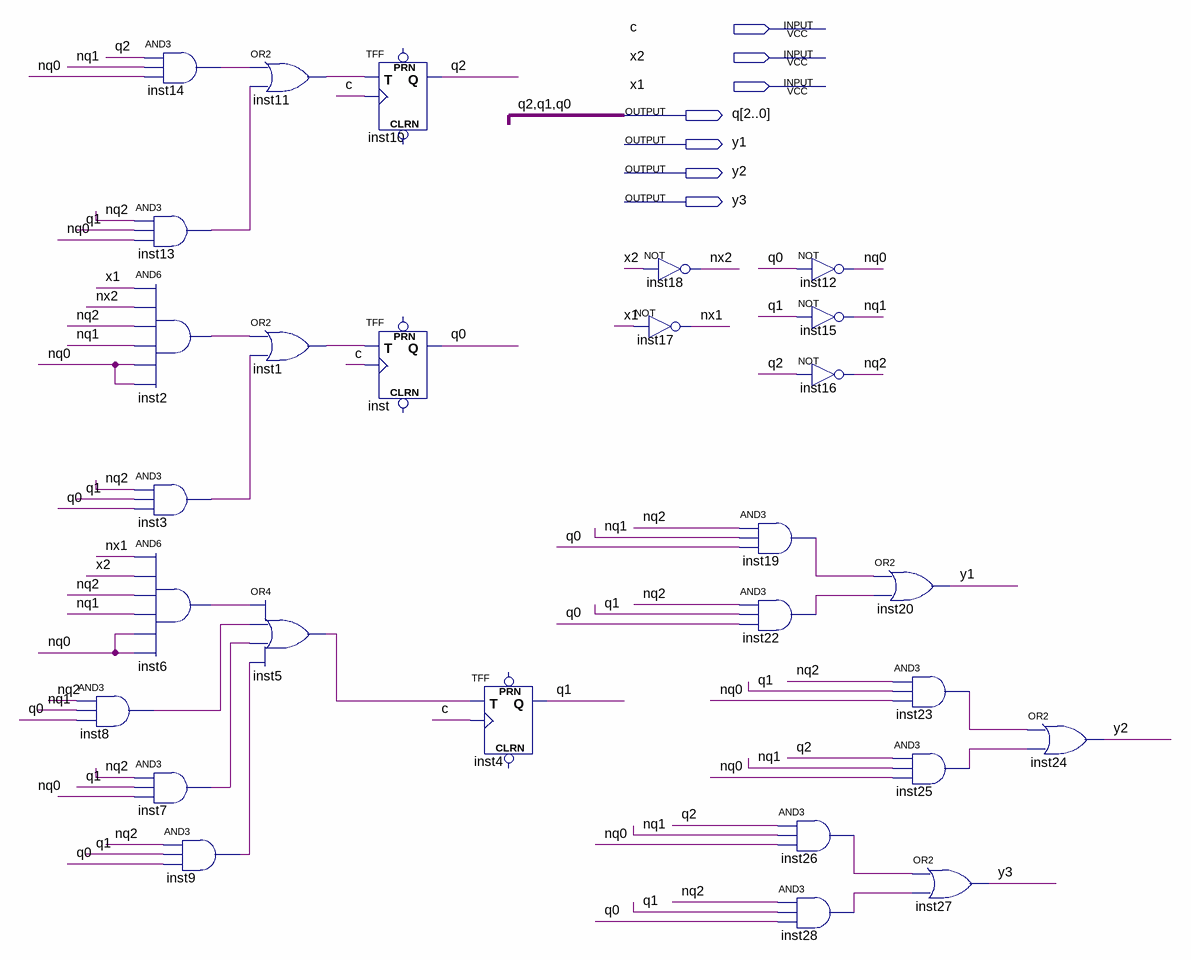
[diagram p0: schematic sheet]
// Quartus schematic sv13.bdf as structural Verilog: 28 symbols, 7 pins
module sv13 (
  input  c,
  input  x2,
  input  x1,
  output [2:0] q,
  output y1,
  output y2,
  output y3
);

  wire inst1_out, inst2_out, inst3_out, inst5_out, inst6_out, inst7_out, inst8_out, inst9_out, inst11_out,
       inst13_out, inst14_out, inst19_out, inst22_out, inst23_out, inst25_out, inst26_out, inst28_out, nq0,
       nq1, nq2, nx1, nx2;

  and inst8 (inst8_out, nq2, nq1, q[0]);
  and inst14 (inst14_out, q[2], nq1, nq0);
  and inst13 (inst13_out, nq2, q[1], nq0);
  and inst2 (inst2_out, x1, nx2, nq2, nq1, nq0, nq0);
  and inst3 (inst3_out, nq2, q[1], q[0]);
  and inst6 (inst6_out, nx1, x2, nq2, nq1, nq0, nq0);
  and inst7 (inst7_out, nq2, q[1], nq0);
  and inst9 (inst9_out, nq2, q[1], q[0]);
  or inst11 (inst11_out, inst14_out, inst13_out);
  or inst1 (inst1_out, inst2_out, inst3_out);
  or inst5 (inst5_out, inst6_out, inst8_out, inst7_out, inst9_out);
  TFF inst10 (.T(inst11_out), .CLK(c), .Q(q[2]));  // open: PRN, CLRN
  TFF inst (.T(inst1_out), .CLK(c), .Q(q[0]));  // open: PRN, CLRN
  TFF inst4 (.T(inst5_out), .CLK(c), .Q(q[1]));  // open: PRN, CLRN
  not inst17 (nx1, x1);
  not inst18 (nx2, x2);
  and inst19 (inst19_out, nq2, nq1, q[0]);
  and inst22 (inst22_out, nq2, q[1], q[0]);
  and inst26 (inst26_out, q[2], nq1, nq0);
  and inst28 (inst28_out, nq2, q[1], q[0]);
  not inst12 (nq0, q[0]);
  not inst15 (nq1, q[1]);
  not inst16 (nq2, q[2]);
  or inst20 (y1, inst19_out, inst22_out);
  and inst23 (inst23_out, nq2, q[1], nq0);
  and inst25 (inst25_out, q[2], nq1, nq0);
  or inst27 (y3, inst26_out, inst28_out);
  or inst24 (y2, inst23_out, inst25_out);
endmodule
